# EAGLE design HUB_FPC_test (EAGLE 4.16)
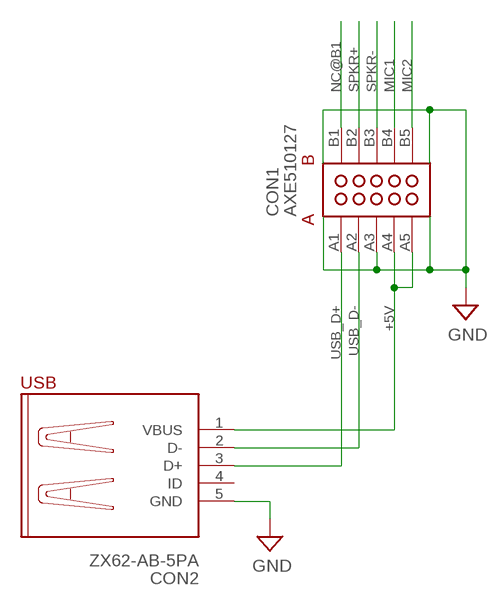
[diagram p0: schematic, sheet 1]

## Parts
CON1  AXE510127  [AXE510127]
CON2  ZX62-AB-5PA  [ZX62-AB-5PA]

## Nets
+5V: CON1.A4 CON1.A5 CON2.1(VBUS)
GND: CON1.A3 CON1.GUIDE@L1(GUIDE) CON1.GUIDE@L2(GUIDE) CON1.GUIDE@R1(GUIDE) CON1.GUIDE@R2(GUIDE) CON2.5(GND)
MIC1: CON1.B4
MIC2: CON1.B5
NC@B1: CON1.B1
SPKR+: CON1.B2
SPKR-: CON1.B3
USB_D+: CON1.A1 CON2.3(D+)
USB_D-: CON1.A2 CON2.2(D-)
Unconnected: CON2.4(ID)

## Power pins joined to a net without a drawn wire
GND: CON2.GUIDE@L1(GND) CON2.GUIDE@L3(GND) CON2.GUIDE@R1(GND) CON2.GUIDE@R3(GND)

## Library data of the parts
CON1 = additional:AXE510127: Narrow pitch connectors A4S (0.4mm pitch) 10 pins socket
CON2 = additional:ZX62-AB-5PA: USB Micro-AB Connector

## Board
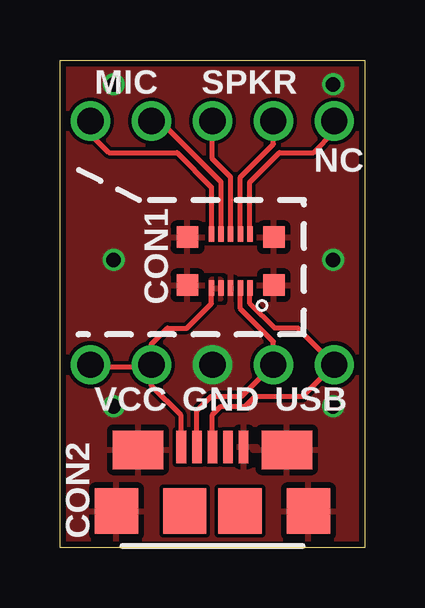
[diagram p1: board, top side]
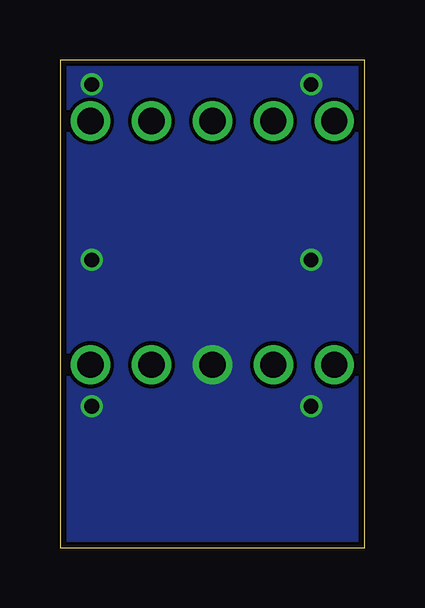
[diagram p2: board, bottom side, seen from below]

Size 12.7 x 20.32 mm. Coordinates in mm from the lower left corner, seen from the top.
Outline: 0,0 0,20.32 12.7,20.32 12.7,0 0,0
Copper layers (1*16): Top 0.035mm / dielectric 1.5mm / Bottom 0.035mm
Design rules "SeeedStudio_2layer_DRU_no_angle_20140221": minimum track width 6mil, minimum drill 12mil, track to track 6mil, track to pad 6mil, pad to pad 6mil, via to via 6mil, smd to smd 0mil, copper to edge 10mil, drill to drill 10mil, minimum pad ring 10mil, minimum via ring 6mil, stop-mask expansion 2mil, vias tented up to drill 100mil, thermal gap 10mil

### Footprints (pad centres in the part's own frame; a part is rotated, then mirrored left to right if it is on the bottom)
AXE510127 = smd 0.23 x 0.65: A1 -0.8,1.125; A2 -0.4,1.125; A3 0,1.125; A4 0.4,1.125; A5 0.8,1.125; B1 -0.8,-1.125; B2 -0.4,-1.125; B3 0,-1.125; B4 0.4,-1.125; B5 0.8,-1.125 | smd 0.9 x 0.9: GUIDE@L1 -1.8,-1; GUIDE@L2 -1.8,1; GUIDE@R1 1.8,-1; GUIDE@R2 1.8,1
ZX62-AB-5PA = smd 0.4 x 1.35: 1 -1.3,2.675; 2 -0.65,2.675; 3 0,2.675; 4 0.65,2.675; 5 1.3,2.675 | smd 2.1 x 1.6: GUIDE@L1 -3.1,2.55; GUIDE@R1 3.1,2.55 | smd 1.8 x 1.9: GUIDE@L2 -1.15,0; GUIDE@L3 -4,0; GUIDE@R2 1.15,0; GUIDE@R3 4,0

### Placement (x,y rotation side)
CON1  7.11,11.94 180 top
CON2  6.35,1.52 0 top

### Tracks (layer width: path | path; a pad name or v marks a point on that pad's centre or on a via)
+5V  (via drill 1.09)
  Top 0.203: CON1.A5 6.31,10.17 5.28,9.14 4.47,9.14 3.81,8.48 v3.81,7.62 | v1.27,7.62 1.37,7.52 3.71,7.52 v3.81,7.62 | CON2.1 5.05,5.52 3.81,6.76 v3.81,7.62
  pour Top: 6.3,11.18 6.3,10.36 6.71,10.36 6.71,11.18
GND  (via drill 0.61, 1.09)
  other vias: 6.35,7.62 2.24,11.99 2.24,5.89 11.38,11.99 11.38,5.89 2.24,19.3 11.38,19.3
  pour Top (rank 2): 0,20.32 0,0 12.7,0 12.7,20.32
  pour Bottom (rank 2): 0,20.32 0,0 12.7,0 12.7,20.32
MIC1  (via drill 1.09)
  Top 0.203: CON1.B4 6.71,15.23 4.17,17.78 v3.81,17.78
MIC2  (via drill 1.09)
  Top 0.203: CON1.B5 6.31,15.02 4.88,16.46 2.03,16.46 1.27,17.22 v1.27,17.78
NC@B1  (via drill 1.09)
  Top 0.203: CON1.B1 7.91,15.23 9.14,16.46 10.57,16.46 11.43,17.32 v11.43,17.78
SPKR+  (via drill 1.09)
  Top 0.203: CON1.B2 7.51,15.44 8.89,16.82 v8.89,17.78
SPKR-  (via drill 1.09)
  Top 0.203: v6.35,17.78 6.35,16.2 7.11,15.44 CON1.B3
USB_D+  (via drill 1.09)
  Top 0.203: CON1.A1 7.91,10.17 8.94,9.14 9.91,9.14 v11.43,7.62 10.11,6.3 9.14,6.3 8.13,6.3 7.72,5.89 6.71,5.89 6.35,5.54 CON2.3
USB_D-  (via drill 1.09)
  Top 0.203: CON2.2 5.7,5.7 6.3,6.3 7.57,6.3 v8.89,7.62 8.89,8.59 7.51,9.96 CON1.A2

### Text on the board
tPlace: MIC | SPKR | NC | VCC | GND | USB